# EAGLE design arduino-day-arduino (EAGLE 9.2.1)
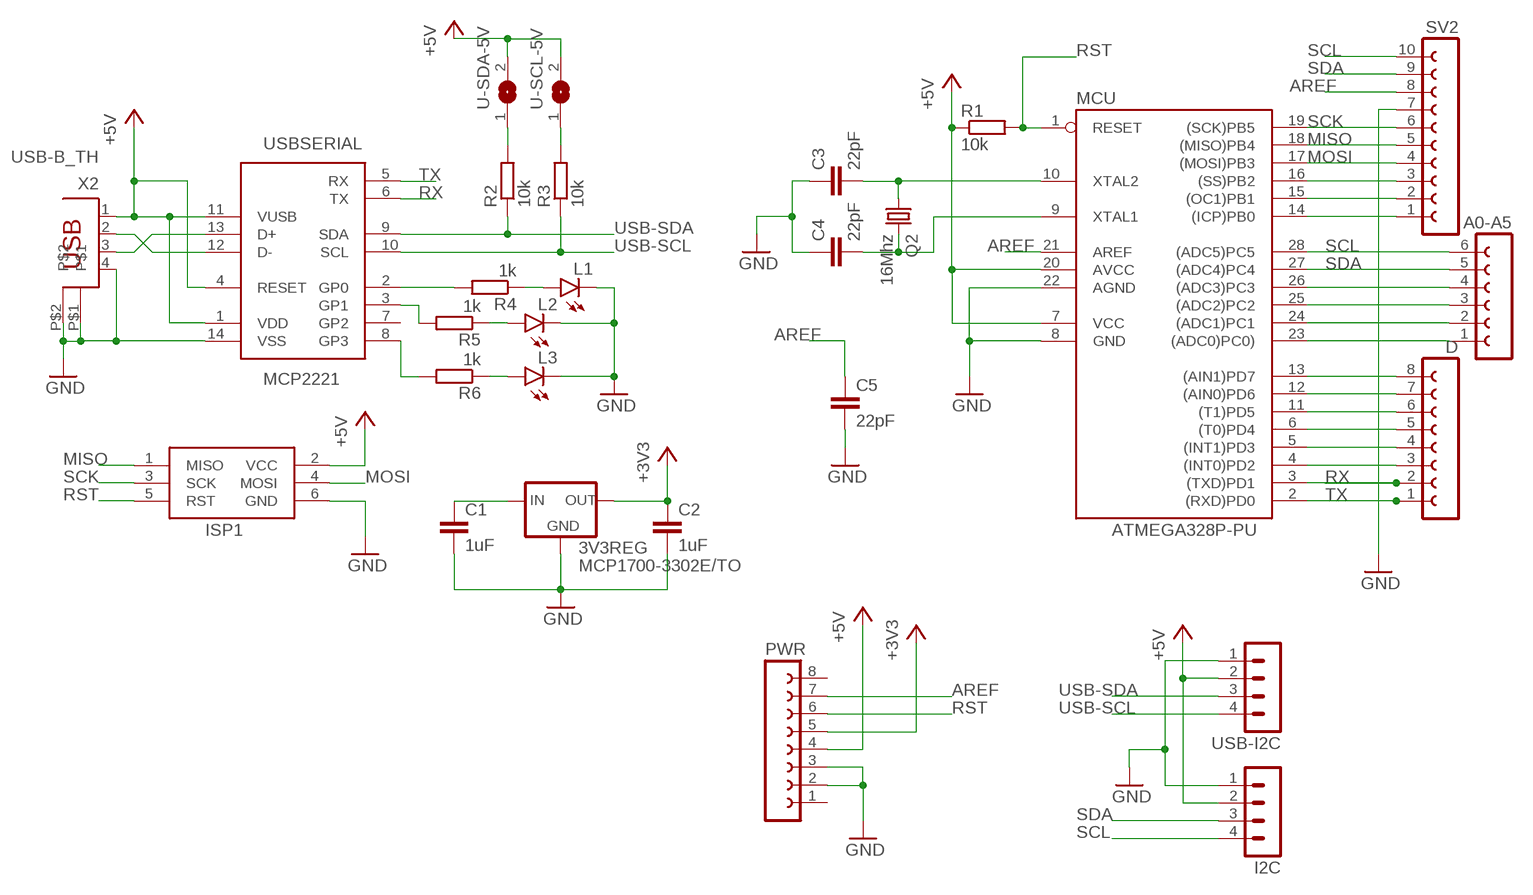
[diagram p0: schematic, sheet 1]

## Parts
3V3REG  MCP1700-3302E/TO  MCP1700TRI  [TO92]
A0-A5  FE06-1  [FE06]
C1  1uF  C-EU025-025X050  [C025-025X050]
C2  1uF  C-EU025-025X050  [C025-025X050]
C3  22pF  C-EU025-025X050  [C025-025X050]
C4  22pF  C-EU025-025X050  [C025-025X050]
C5  22pF  C-EU025-025X050  [C025-025X050]
D  FE08-1  [FE08]
I2C  MA04-1  [MA04-1]
ISP1  AVRISP-6  [AVRISP]
L1  LED3MM  [LED3MM]
L2  LED3MM  [LED3MM]
L3  LED3MM  [LED3MM]
MCU  ATMEGA328P-PU  [DIL28-3]
PWR  FE08-1  [FE08]
Q2  16Mhz  CRYSTALHC49S  [HC49/S]
R1  10k  R-EU_0204/7  [0204/7]
R2  10k  R-EU_0204/7  [0204/7]
R3  10k  R-EU_0204/7  [0204/7]
R4  1k  R-EU_0204/7  [0204/7]
R5  1k  R-EU_0204/7  [0204/7]
R6  1k  R-EU_0204/7  [0204/7]
SV2  FE10-1  [FE10]
U-SCL-5V  SJW  [SJW]
U-SDA-5V  SJW  [SJW]
USB-I2C  MA04-1  [MA04-1]
USBSERIAL  MCP2221  [DIL14]
X2  USB-B_TH  PN61729  [PN61729]

## Nets
+3V3: 3V3REG.3(OUT) C2.1 PWR.5
+5V: I2C.2 ISP1.2(VCC) MCU.7(VCC) MCU.20(AVCC) PWR.4 R1.1 U-SCL-5V.2 U-SDA-5V.2 USB-I2C.2 USBSERIAL.1(VDD) USBSERIAL.4(RESET) USBSERIAL.11(VUSB) X2.1
AREF: C5.1 MCU.21(AREF) PWR.7 SV2.8
GND: 3V3REG.1(GND) C1.2 C2.2 C3.1 C4.1 C5.2 I2C.1 ISP1.6(GND) L1.K(C) L2.K(C) L3.K(C) MCU.8(GND) MCU.22(AGND) PWR.2 PWR.3 SV2.7 USB-I2C.1 USBSERIAL.14(VSS) X2.4 X2.P$1 X2.P$2
LED_RX: R4.2 USBSERIAL.2(GP0)
LED_TX: R5.2 USBSERIAL.3(GP1)
MISO: ISP1.1(MISO) MCU.18((MISO)PB4) SV2.5
MOSI: ISP1.4(MOSI) MCU.17((MOSI)PB3) SV2.4
N$1: 3V3REG.2(IN) C1.1
N$2: D.3 MCU.4((INT0)PD2)
N$3: D.4 MCU.5((INT1)PD3)
N$4: D.5 MCU.6((T0)PD4)
N$5: D.6 MCU.11((T1)PD5)
N$6: D.7 MCU.12((AIN0)PD6)
N$7: D.8 MCU.13((AIN1)PD7)
N$8: A0-A5.1 MCU.23((ADC0)PC0))
N$9: A0-A5.2 MCU.24((ADC1)PC1)
N$10: A0-A5.3 MCU.25((ADC2)PC2)
N$11: A0-A5.4 MCU.26((ADC3)PC3)
N$14: MCU.14((ICP)PB0) SV2.1
N$15: MCU.15((OC1)PB1) SV2.2
N$16: MCU.16((SS)PB2) SV2.3
N$17: R2.2 U-SDA-5V.1
N$18: R3.2 U-SCL-5V.1
N$26: USBSERIAL.12(D-) X2.2
N$27: USBSERIAL.13(D+) X2.3
N$28: L1.A R4.1
N$29: L2.A R5.1
N$30: L3.A R6.1
N$31: R6.2 USBSERIAL.8(GP3)
N$37: C3.2 MCU.10(XTAL2) Q2.1
N$38: C4.2 MCU.9(XTAL1) Q2.2
RST: ISP1.5(RST) MCU.1(RESET) PWR.6 R1.2
RX: D.2 MCU.3((TXD)PD1) USBSERIAL.6(TX)
SCK: ISP1.3(SCK) MCU.19((SCK)PB5) SV2.6
SCL: A0-A5.6 I2C.4 MCU.28((ADC5)PC5) SV2.10
SDA: A0-A5.5 I2C.3 MCU.27((ADC4)PC4) SV2.9
TX: D.1 MCU.2((RXD)PD0) USBSERIAL.5(RX)
USB-SCL: R3.1 USB-I2C.4 USBSERIAL.10(SCL)
USB-SDA: R2.1 USB-I2C.3 USBSERIAL.9(SDA)
Unconnected: PWR.1 PWR.8 USBSERIAL.7(GP2)

## Library data of the parts
3V3REG = adafruit:MCP1700: VOLTAGE REGULATOR
A0-A5 = con-lsta:FE06-1: FEMALE HEADER; OC_FARNELL: unknown; OC_NEWARK: unknown
C1-C5 = rcl:C-EU: CAPACITOR, European symbol; SPICEPREFIX: C
D PWR = con-lsta:FE08-1: FEMALE HEADER; OC_FARNELL: unknown; OC_NEWARK: unknown
I2C USB-I2C = con-lstb:MA04-1: PIN HEADER; OC_FARNELL: unknown; OC_NEWARK: unknown
ISP1 = adafruit:AVRISP: AVR ISP HEADER Standard 6 pin header for AVR programming
L1-L3 = led:LED: LED OSRAM: - CHIPLED LG R971, LG N971, LY N971, LG Q971, LY Q971, LO R971, LY R971 LH N974, LH R974 LS Q976, LO Q976, LY Q976 LO Q996 - Hyper CHIPLED LW Q18S LB Q993, LB Q99A, LB R99A - SideLED LS A670, LO A670, LY A670, LG A670, LP A670 LB A673, LV A673, LT A673, LW A673 LH A674 LY A675 LS A676, LA A676, LO A676, LY A676, LW A676 LS A679, LY A679, LG A679 - Hyper Micro SIDELED® LS Y876, LA Y876, LO Y876, LY Y876 LT Y87S - SmartLED LW L88C, LW L88S LB L89C, LB L89S, LG L890 LS L89K, LO L89K, LY L89K LS L896, LA L896, LO L896, LY L896 - TOPLED LS T670, LO T670, LY T670, LG T670, LP T670 LSG T670, LSP T670, LSY T670, LOP T670, LYG T670 LG T671, LOG T671, LSG T671 LB T673, LV T673, LT T673, LW T673 LH T674 LS T676, LA T676, LO T676, LY T676, LB T676, LH T676, LSB T676, LW T676 LB T67C, LV T67C, LT T67C, LS T67K, LO T67K, LY T67K, LW E67C LS E67B, LA E67B, LO E67B, LY E67B, LB E67C, LV E67C, LT E67C LW T67C LS T679, LY T679, LG T679 LS T770, LO T770, LY T770, LG T770, LP T770 LB T773, LV T773, LT T773, LW T773 LH T774 LS E675, LA E675, LY E675, LS T675 LS T776, LA T776, LO T776, LY T776, LB T776 LHGB T686 LT T68C, LB T68C - Hyper Mini TOPLED® LB M676 - Mini TOPLED Santana® LG M470 LS M47K, LO M47K, LY M47K Source: http://www.osram.convergy.de LUXEON: - LUMILED® LXK2-PW12-R00, LXK2-PW12-S00, LXK2-PW14-U00, LXK2-PW14-V00 LXK2-PM12-R00, LXK2-PM12-S00, LXK2-PM14-U00 LXK2-PE12-Q00, LXK2-PE12-R00, LXK2-PE12-S00, LXK2-PE14-T00, LXK2-PE14-U00 LXK2-PB12-K00, LXK2-PB12-L00, LXK2-PB12-M00, LXK2-PB14-N00, LXK2-PB14-P00, LXK2-PB14-Q00 LXK2-PR12-L00, LXK2-PR12-M00, LXK2-PR14-Q00, LXK2-PR14-R00 LXK2-PD12-Q00, LXK2-PD12-R00, LXK2-PD12-S00 LXK2-PH12-R00, LXK2-PH12-S00 LXK2-PL12-P00, LXK2-PL12-Q00, LXK2-PL12-R00 Source: www.luxeon.com KINGBRIGHT: KA-3528ASYC Source: www.kingbright.com
MCU = SmartPrj:ATMEGA328P-: MICROCONTROLLER 4 Kbytes FLASH 128 bytes SRAM 256 bytes EEPROM UART 6-channel 10 bit ADC
Q2 = crystal:CRYSTAL: CRYSTAL; OC_FARNELL: 1667008; OC_NEWARK: unknown
R1-R6 = rcl:R-EU_: RESISTOR, European symbol
SV2 = con-lsta:FE10-1: FEMALE HEADER; OC_FARNELL: unknown; OC_NEWARK: unknown
U-SCL-5V U-SDA-5V = jumper:SJ: SMD solder JUMPER
USBSERIAL = Webmaster442:MCP2221: Dual In Line / Socket
X2 = SmartPrj:PN61729: BERG USB connector

## Board
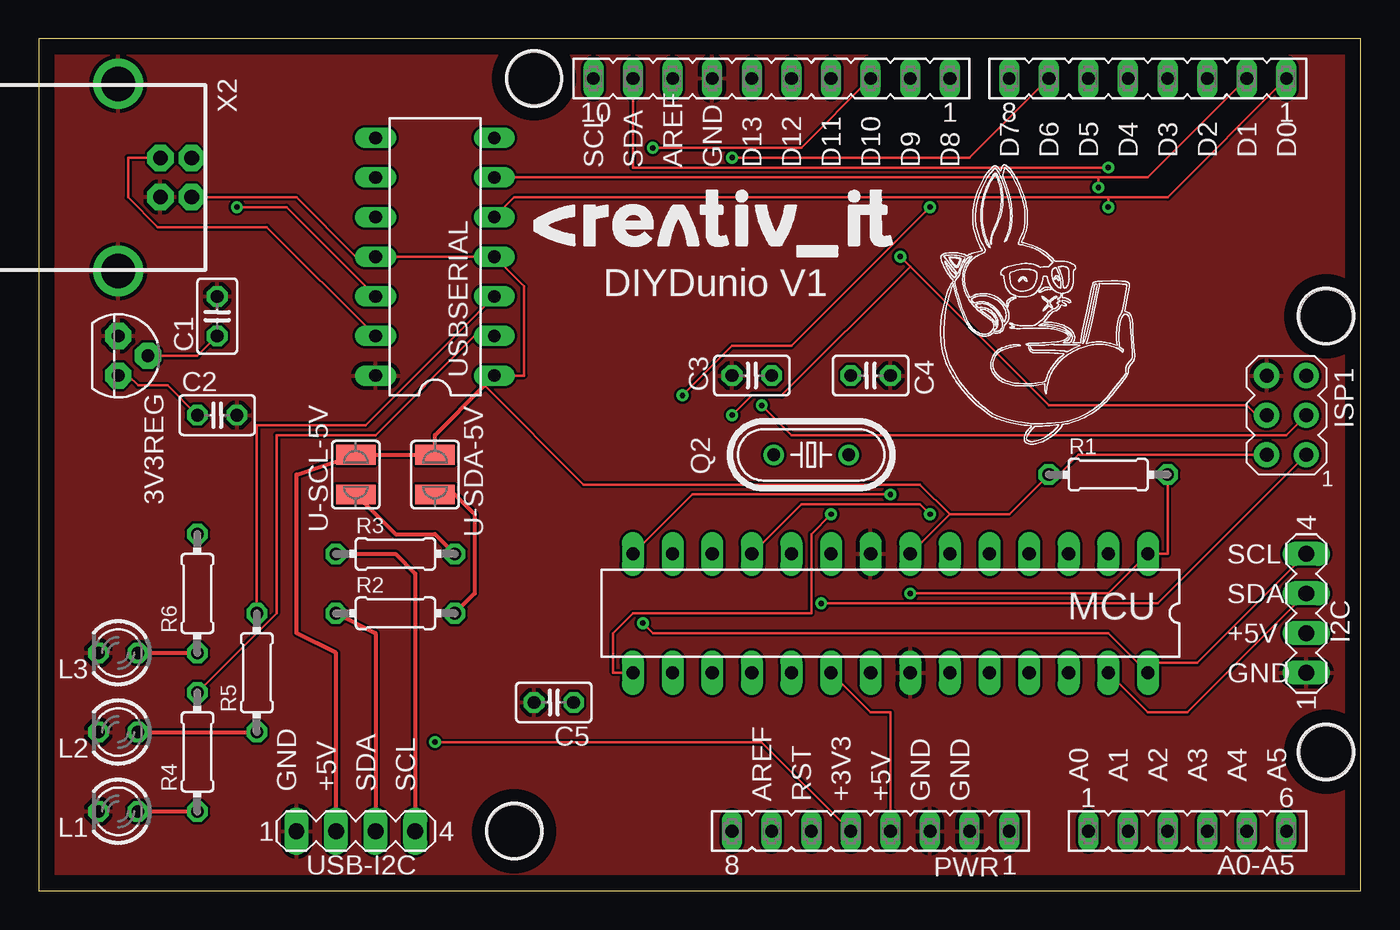
[diagram p1: board, top side]
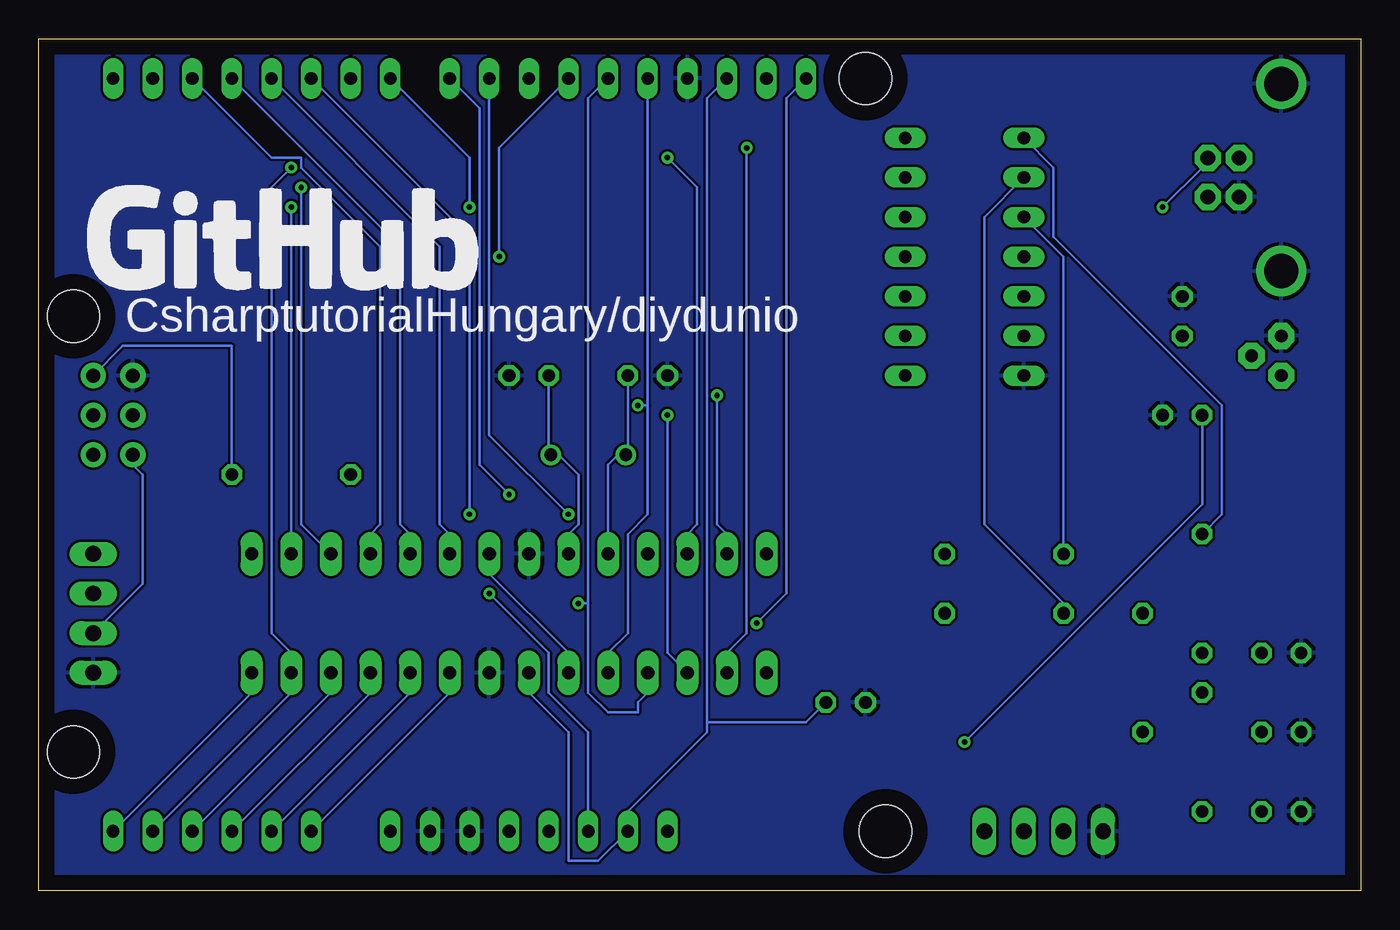
[diagram p2: board, bottom side, seen from below]

Size 84.76 x 54.6 mm. Coordinates in mm from the lower left corner, seen from the top.
Outline: 0,0 84.76,0 84.76,54.6 0,54.6 0,0
Copper layers (1*16): Top 0.035mm / dielectric 1.5mm / Bottom 0.035mm
Design rules "default": minimum track width 6mil, minimum drill 0.35mm, track to track 6mil, track to pad 6mil, pad to pad 6mil, via to via 6mil, smd to smd 6mil, copper to edge 40mil, drill to drill 6mil, minimum pad ring 10mil, minimum via ring 8mil, stop-mask expansion 4mil, vias tented up to drill 0mil, thermal gap 10mil
Holes 3.35 mm at 31.75,52.07 30.48,3.81 82.55,8.89 82.55,36.83

### Footprints (pad centres in the part's own frame; a part is rotated, then mirrored left to right if it is on the bottom)
TO92 = drill 0.813 pad 1.676 octagon: 1 -1.27,0; 2 0,1.905; 3 1.27,0
FE06 = drill 0.813 long: 1 -6.35,0; 2 -3.81,0; 3 -1.27,0; 4 1.27,0; 5 3.81,0; 6 6.35,0
C025-025X050 = drill 0.813 octagon: 1 -1.27,0; 2 1.27,0
FE08 = drill 0.813 long: 1 -8.89,0; 2 -6.35,0; 3 -3.81,0; 4 -1.27,0; 5 1.27,0; 6 3.81,0; 7 6.35,0; 8 8.89,0
MA04-1 = drill 1.016 long: 1 -3.81,0; 2 -1.27,0; 3 1.27,0; 4 3.81,0
AVRISP = drill 0.9 pad 1.626: 1 -1.27,2.54; 2 1.27,2.54; 3 -1.27,0; 4 1.27,0; 5 -1.27,-2.54; 6 1.27,-2.54
LED3MM = drill 0.813 octagon: A -1.27,0; K 1.27,0
DIL28-3 = drill 0.85 pad 1.422 long: 1 -16.51,-3.81; 2 -13.97,-3.81; 3 -11.43,-3.81; 4 -8.89,-3.81; 5 -6.35,-3.81; 6 -3.81,-3.81; 7 -1.27,-3.81; 8 1.27,-3.81; 9 3.81,-3.81; 10 6.35,-3.81; 11 8.89,-3.81; 12 11.43,-3.81; 13 13.97,-3.81; 14 16.51,-3.81; 15 16.51,3.81; 16 13.97,3.81; 17 11.43,3.81; 18 8.89,3.81; 19 6.35,3.81; 20 3.81,3.81; 21 1.27,3.81; 22 -1.27,3.81; 23 -3.81,3.81; 24 -6.35,3.81; 25 -8.89,3.81; 26 -11.43,3.81; 27 -13.97,3.81; 28 -16.51,3.81
HC49/S = drill 0.813: 1 -2.413,0; 2 2.413,0
0204/7 = drill 0.813 octagon: 1 -3.81,0; 2 3.81,0
FE10 = drill 0.813 long: 1 -11.43,0; 2 -8.89,0; 3 -6.35,0; 4 -3.81,0; 5 -1.27,0; 6 1.27,0; 7 3.81,0; 8 6.35,0; 9 8.89,0; 10 11.43,0
SJW = smd 1.27 x 2.54: 1 -1.27,0; 2 1.27,0
DIL14 = drill 0.813 long: 1 -7.62,-3.81; 2 -5.08,-3.81; 3 -2.54,-3.81; 4 0,-3.81; 5 2.54,-3.81; 6 5.08,-3.81; 7 7.62,-3.81; 8 7.62,3.81; 9 5.08,3.81; 10 2.54,3.81; 11 0,3.81; 12 -2.54,3.81; 13 -5.08,3.81; 14 -7.62,3.81
PN61729 = drill 0.95 pad 1.676 octagon: 1 1.25,4.71; 2 -1.25,4.71; 3 -1.25,2.71; 4 1.25,2.71 | drill 2.2: P$1 -6,0; P$2 6,0

### Placement (x,y rotation side)
3V3REG  5.08,34.29 270 top
A0-A5  73.66,3.81 0 top
C1  11.43,36.83 90 top
C2  11.43,30.48 0 top
C3  45.72,33.02 0 top
C4  53.34,33.02 180 top
C5  33.02,12.06 180 top
D  71.12,52.07 180 top
I2C  81.28,17.78 90 top
ISP1  80.01,30.48 180 top
L1  5.08,5.08 180 top
L2  5.08,10.16 180 top
L3  5.08,15.24 180 top
MCU  54.61,17.78 180 top
PWR  53.34,3.81 180 top
Q2  49.53,27.94 0 top
R1  68.58,26.67 0 top
R2  22.86,17.78 0 top
R3  22.86,21.59 0 top
R4  10.16,8.89 90 top
R5  13.97,13.97 90 top
R6  10.16,19.05 90 top
SV2  46.99,52.07 180 top
U-SCL-5V  20.32,26.67 90 top
U-SDA-5V  25.4,26.67 90 top
USB-I2C  20.32,3.81 0 top
USBSERIAL  25.4,40.64 90 top
X2  5.08,45.72 270 top

### Tracks (layer width: path | path; a pad name or v marks a point on that pad's centre or on a via)
+3V3  (via drill 0.35)
  Top 0.152: C2.1 8.26,32.38 6.35,32.38 5.71,33.02 3V3REG.3 | PWR.5 46.35,9.52 v25.4,9.52
  Bottom 0.152: v25.4,9.52 10.16,24.77 C2.1
+5V
  Top 0.152: X2.1 10.16,44.45 16.51,44.45 20.32,40.64 USBSERIAL.11 USBSERIAL.4 31.12,38.73 31.12,33.02 USBSERIAL.1 | PWR.4 54.61,11.43 53.34,11.43 MCU.20 | 58.42,24.13 62.23,24.13 R1.1 65.41,26.67 66.68,27.94 ISP1.2 | MCU.7 58.42,24.13 | 28.57,32.38 34.92,26.03 56.52,26.03 58.42,24.13
  Top 0.254: USBSERIAL.1 28.57,32.38 25.4,29.21 U-SDA-5V.2 U-SCL-5V.2 16.51,26.67 16.51,16.51 19.05,15.24 USB-I2C.2
  Bottom 0.152: I2C.2 78.11,19.68 78.11,26.67 78.74,27.3 ISP1.2 | MCU.20 50.8,15.24 55.88,20.32 MCU.7
AREF
  Bottom 0.152: MCU.21 53.34,12.7 50.8,10.16 50.8,1.9 48.89,1.9 PWR.7 46.99,5.08 41.91,10.16 41.91,10.79 | SV2.8 41.91,50.8 41.91,10.79 | C5.1 35.56,10.79 41.91,10.79
GND
  pour Top: 0,54.61 85.09,54.61 85.09,0 0,0
  pour Bottom: 0,54.61 85.09,54.61 85.09,0 0,0
LED_RX
  Top 0.152: R4.2 15.24,17.78 15.24,29.21 21.59,29.21 27.94,35.56 USBSERIAL.2
LED_TX
  Top 0.152: R5.2 13.97,29.84 20.95,29.84 USBSERIAL.3
MISO  (via drill 0.35)
  Top 0.152: ISP1.1 71.76,18.41 v50.16,18.41
  Bottom 0.152: SV2.5 49.53,50.8 49.53,18.41 | 49.53,18.41 49.53,12.7 48.26,11.43 46.35,11.43 46.35,12.06 45.72,12.7 MCU.18 | 49.53,18.41 v50.16,18.41
MOSI  (via drill 0.35)
  Top 0.152: 55.88,40.01 64.77,31.12 77.47,31.12 78.11,30.48 ISP1.4 | 55.88,40.01 v55.24,40.64 | v44.45,30.48 45.72,31.75 47.62,31.75 55.88,40.01
  Bottom 0.152: SV2.4 55.24,47.62 v55.24,40.64 | MCU.17 44.45,15.24 v44.45,30.48
N$1
  Top 0.152: C1.1 10.16,34.29 3V3REG.2
N$2
  Bottom 0.152: D.3 69.85,46.99 67.95,46.99 67.95,46.35 62.87,41.27 62.87,23.49 63.5,22.86 MCU.4
N$3
  Bottom 0.152: D.4 61.59,41.27 61.59,23.49 60.96,22.86 MCU.5
N$4
  Bottom 0.152: D.5 59.05,41.27 59.05,23.49 58.42,22.86 MCU.6
N$5  (via drill 0.35)
  Top 0.152: v57.15,24.13 56.52,24.77 48.89,24.77 MCU.11
  Bottom 0.152: D.6 57.15,41.91 v57.15,24.13
N$6  (via drill 0.35)
  Top 0.152: D.7 59.69,46.99 v44.45,46.99
  Bottom 0.152: v44.45,46.99 42.55,45.09 42.55,23.49 43.18,22.86 MCU.12
N$7  (via drill 0.35)
  Top 0.152: v57.15,43.81 48.26,34.92 44.45,34.92 v41.27,31.75
  Bottom 0.152: D.8 57.15,46.99 v57.15,43.81 | v41.27,31.75 41.27,23.49 40.64,22.86 MCU.13
N$8
  Bottom 0.152: A0-A5.1 58.42,12.7 MCU.23
N$9
  Bottom 0.152: A0-A5.2 60.96,12.7 MCU.24
N$10
  Bottom 0.152: A0-A5.3 63.5,12.7 MCU.25
N$11
  Bottom 0.152: A0-A5.4 66.04,12.7 MCU.26
N$14  (via drill 0.35)
  Top 0.152: v54.61,25.4 41.91,25.4 MCU.14
  Bottom 0.152: SV2.1 56.52,50.16 56.52,27.3 v54.61,25.4
N$15  (via drill 0.35)
  Top 0.152: v50.8,24.13 49.53,22.86 49.53,17.78 38.1,17.78 36.83,16.51 36.83,13.97 MCU.15
  Bottom 0.152: SV2.2 55.88,29.21 v50.8,24.13
N$16  (via drill 0.35)
  Top 0.152: SV2.3 48.89,47.62 v39.37,47.62
  Bottom 0.152: v39.37,47.62 39.37,16.51 40.64,15.24 MCU.16
N$17
  Top 0.254: U-SDA-5V.1 26.67,25.4 27.94,24.13 27.94,19.05 R2.2
N$18
  Top 0.254: U-SCL-5V.1 22.86,22.86 25.4,22.86 R3.2
N$26  (via drill 0.35)
  Top 0.152: USBSERIAL.12 15.88,43.81 v12.7,43.81
  Bottom 0.152: v12.7,43.81 10.16,46.35 X2.2
N$27
  Top 0.152: USBSERIAL.13 14.6,42.55 7.62,42.55 5.71,44.45 5.71,46.99 7.62,46.99 X2.3
N$28
  Top 0.254: L1.A R4.1
N$29
  Top 0.254: L2.A R5.1
N$30
  Top 0.254: L3.A R6.1
N$31
  Bottom 0.152: R6.2 8.89,24.13 8.89,31.12 19.69,41.91 19.69,46.35 USBSERIAL.8
N$37
  Bottom 0.152: C3.2 46.99,27.94 Q2.1 47.62,27.94 48.26,27.3 MCU.10
N$38
  Bottom 0.152: C4.2 52.07,27.94 Q2.2 51.43,27.94 50.16,26.67 50.16,23.49 50.8,22.86 MCU.9
RST  (via drill 0.35)
  Top 0.152: v55.88,19.05 68.58,19.05 MCU.1 72.39,21.59 R1.2
  Bottom 0.152: PWR.6 49.53,10.16 52.07,12.7 52.07,15.24 v55.88,19.05 | ISP1.5 79.38,34.92 72.39,34.92 R1.2
RX  (via drill 0.35)
  Top 0.152: 67.95,45.72 71.12,45.72 D.2 | 67.95,45.72 USBSERIAL.6 | 67.95,45.72 v67.95,45.09
  Bottom 0.152: MCU.3 67.95,23.49 v67.95,45.09
SCK  (via drill 0.35)
  Top 0.152: ISP1.3 80.01,29.21 48.26,29.21 v46.35,31.12
  Bottom 0.152: 45.72,31.12 45.72,24.13 46.99,22.86 46.99,16.51 48.26,15.24 MCU.19 | 45.72,31.12 SV2.6 | 45.72,31.12 v46.35,31.12
SCL  (via drill 0.35)
  Top 0.152: v38.73,17.14 39.37,16.51 68.58,16.51 70.48,14.61 | I2C.4 74.3,14.61 70.48,14.61 | 70.48,14.61 MCU.28
  Bottom 0.152: A0-A5.6 71.12,12.7 MCU.28 | SV2.10 36.83,50.8 36.83,19.05 v38.73,17.14
SDA  (via drill 0.35)
  Top 0.152: SV2.9 38.1,46.35 v68.58,46.35 | I2C.3 73.66,11.43 71.12,11.43 MCU.27
  Bottom 0.152: A0-A5.5 68.58,12.7 MCU.27 68.58,15.24 69.85,16.51 69.85,45.09 v68.58,46.35
TX  (via drill 0.35)
  Top 0.152: USBSERIAL.5 30.48,44.45 68.58,44.45 | 68.58,44.45 72.39,44.45 D.1 | 68.58,44.45 v68.58,43.81
  Bottom 0.152: v68.58,43.81 MCU.2
USB-SCL
  Top 0.254: R3.1 22.86,21.59 24.13,20.32 USB-I2C.4
  Bottom 0.152: USBSERIAL.10 19.05,40.64 R3.1
USB-SDA
  Top 0.254: R2.1 21.59,16.51 USB-I2C.3 21.59,2.54
  Bottom 0.152: USBSERIAL.9 24.13,43.18 24.13,23.49 19.05,18.41 R2.1

### Text on the board
tPlace: D7 | D6 | D5 | D4 | D3 | D2 | D1 | D0 | SCL | SDA | AREF | GND | D13 | D12 | D11 | D10 | D9 | D8 | DIYDunio V1 | SCL | SDA | +5V | GND | A0 | A1 | A2 | A3 | A4 | A5 | GND | +5V | SDA | SCL | AREF | RST | +3V3 | +5V | GND | GND
bPlace: CsharptutorialHungary/diydunio